# EAGLE schematic devboard (EAGLE 6.4)
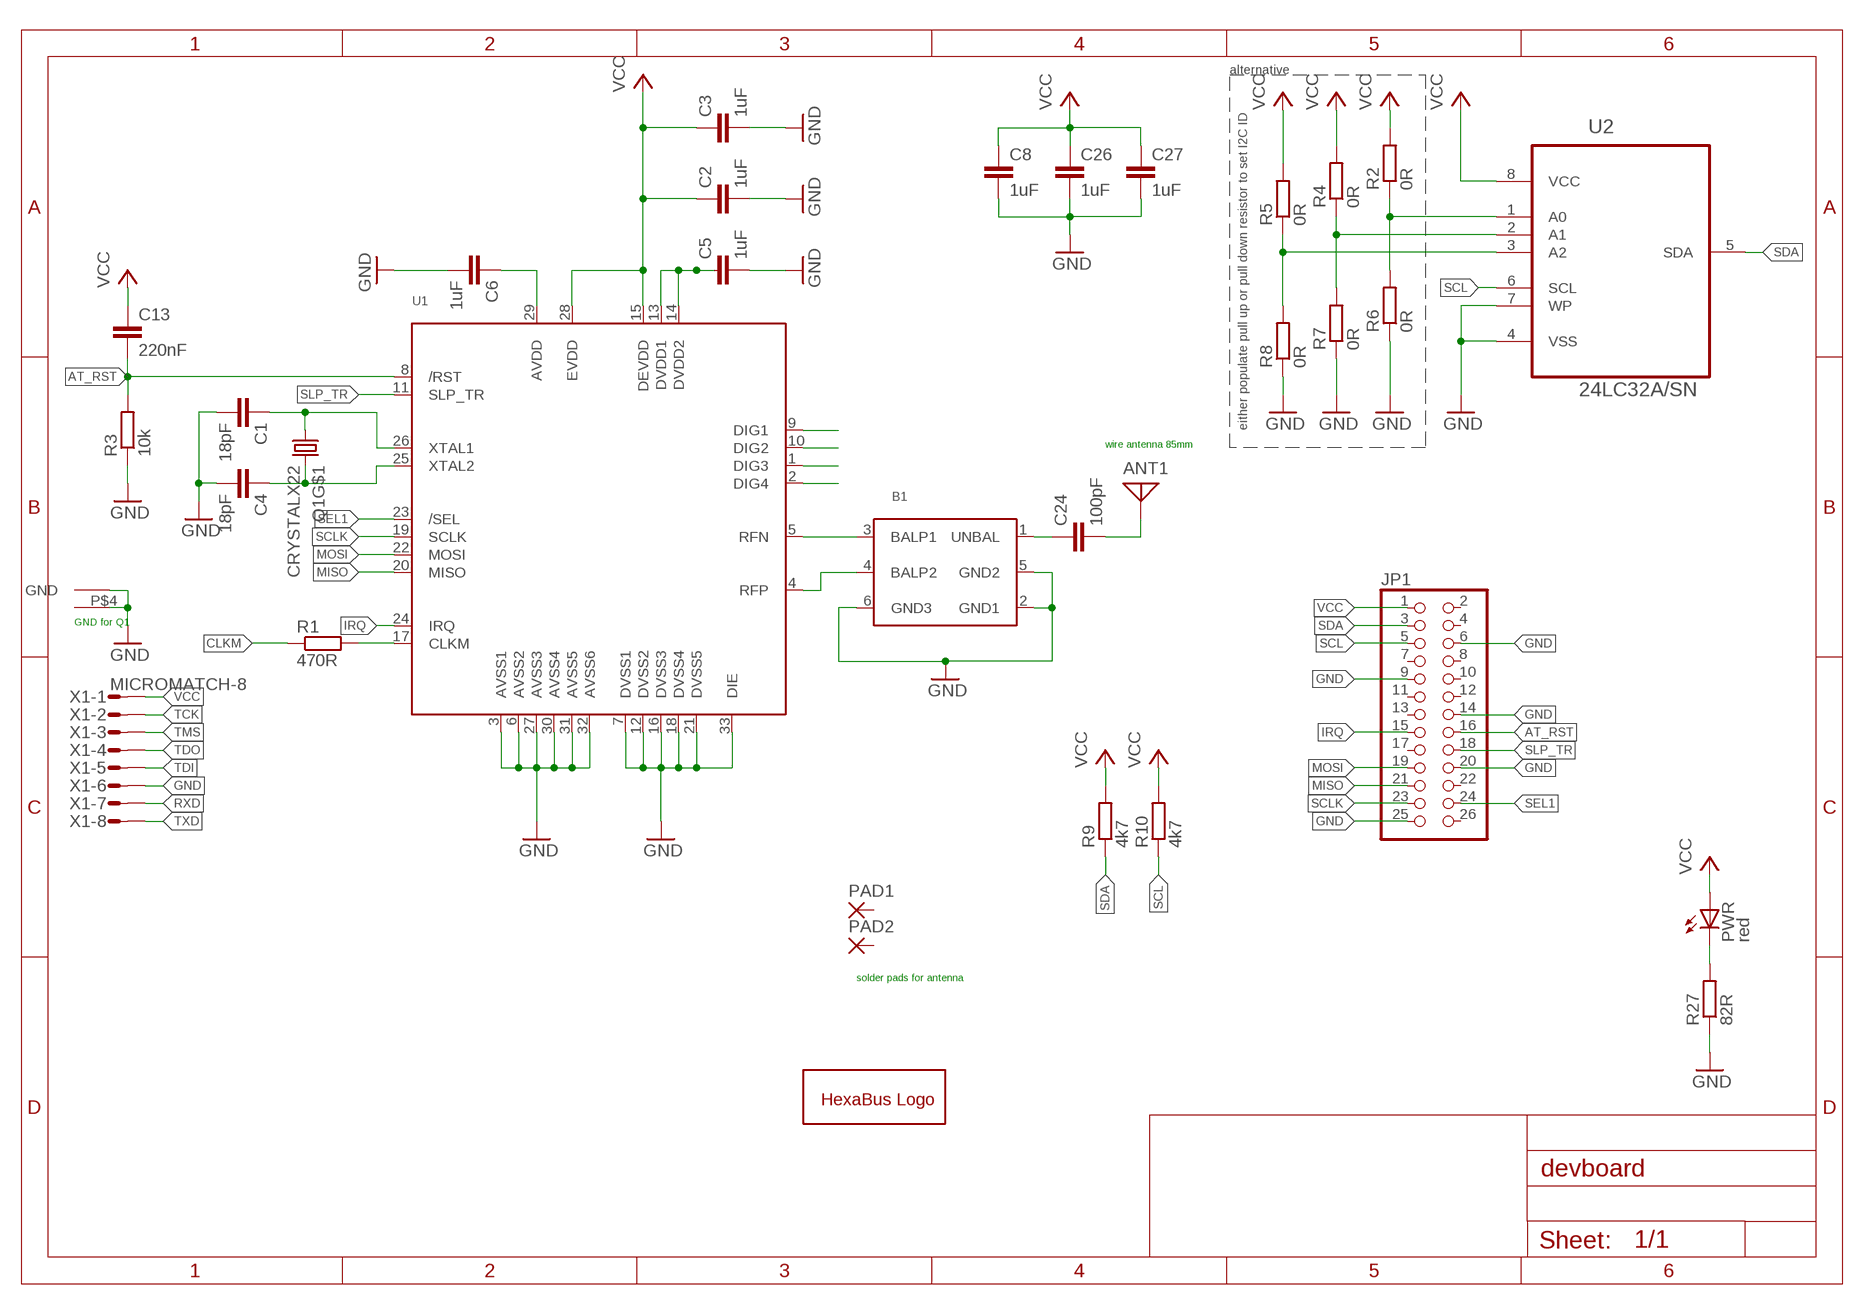
[diagram p0: schematic, sheet 1]

## Parts
ANT1  ANTENNA  [PAD-01]
B1  BALUN+LP  [BALUN0805]
C1  18pF  C-EUC0603  [C0603]
C2  1uF  C-EUC0603  [C0603]
C3  1uF  C-EUC0603  [C0603]
C4  18pF  C-EUC0603  [C0603]
C5  1uF  C-EUC0603  [C0603]
C6  1uF  C-EUC0603  [C0603]
C8  1uF  C-EUC0603  [C0603]
C13  220nF  C-EUC0603  [C0603]
C24  100pF  C-EUC0603  [C0603]
C26  1uF  C-EUC0603  [C0603]
C27  1uF  C-EUC0603  [C0603]
JP1  PINHD-2X13  [2X13]
PAD1  SMD2  [SMD1,27-2,54]
PAD2  SMD2  [SMD1,27-2,54]
PWR  red  LEDCHIP-LED0603  [CHIP-LED0603]
Q1  CRYSTALX22  [X22]
R1  470R  R-EU_R0603  [R0603]
R2  0R  R-EU_R0603  [R0603]
R3  10k  R-EU_R0603  [R0603]
R4  0R  R-EU_R0603  [R0603]
R5  0R  R-EU_R0603  [R0603]
R6  0R  R-EU_R0603  [R0603]
R7  0R  R-EU_R0603  [R0603]
R8  0R  R-EU_R0603  [R0603]
R9  4k7  R-EU_R0603  [R0603]
R10  4k7  R-EU_R0603  [R0603]
R27  82R  R-EU_R0603  [R0603]
U1  AT86RF212  [32QN2]
U2  24LC32A/SN  [SOIC127P600X175-8N]
U$1  HEXAKRAKE  [HEXAKRAKE]
X1  MICROMATCH-8  [MICROMATCH-8]

## Nets
AT_RST: C13.2 JP1.16 R3.2 U1.8(/RST)
CLKM: R1.1
GND: B1.2(GND1) B1.5(GND2) B1.6(GND3) C1.2 C2.2 C3.2 C4.2 C5.2 C6.2 C8.2 C26.2 C27.2 JP1.6 JP1.9 JP1.14 JP1.20 JP1.25 Q1.P$2(GND) Q1.P$4(GND1) R3.1 R6.1 R7.1 R8.1 R27.1 U1.3(AVSS1) U1.6(AVSS2) U1.7(DVSS1) U1.12(DVSS2) U1.16(DVSS3) U1.18(DVSS4) U1.21(DVSS5) U1.27(AVSS3) U1.30(AVSS4) U1.31(AVSS5) U1.32(AVSS6) U1.33(DIE) U2.4(VSS) U2.7(WP) X1.6
IRQ: JP1.15 U1.24(IRQ)
MISO: JP1.21 U1.20(MISO)
MOSI: JP1.19 U1.22(MOSI)
N$1: C6.1 U1.29(AVDD)
N$2: C5.1 U1.13(DVDD1) U1.14(DVDD2)
N$3: U1.9(DIG1)
N$4: R2.1 R6.2 U2.1(A0)
N$5: R1.2 U1.17(CLKM)
N$6: U1.10(DIG2)
N$7: U1.1(DIG3)
N$8: U1.2(DIG4)
N$9: R4.1 R7.2 U2.2(A1)
N$10: R5.1 R8.2 U2.3(A2)
N$28: B1.3(BALP1) U1.5(RFN)
N$29: B1.4(BALP2) U1.4(RFP)
N$30: C1.1 Q1.P$1 U1.26(XTAL1)
N$31: C4.1 Q1.P$3 U1.25(XTAL2)
N$32: PWR.C R27.2
N$33: B1.1(UNBAL) C24.1
N$34: ANT1.1 C24.2
RXD: X1.7
SCL: JP1.5 R10.1 U2.6(SCL)
SCLK: JP1.23 U1.19(SCLK)
SDA: JP1.3 R9.1 U2.5(SDA)
SEL1: JP1.24 U1.23(/SEL)
SLP_TR: JP1.18 U1.11(SLP_TR)
TCK: X1.2
TDI: X1.5
TDO: X1.4
TMS: X1.3
TXD: X1.8
VCC: C2.1 C3.1 C8.1 C13.1 C26.1 C27.1 JP1.1 PWR.A R2.2 R4.2 R5.2 R9.2 R10.2 U1.15(DEVDD) U1.28(EVDD) U2.8(VCC) X1.1
Unconnected: JP1.2 JP1.4 JP1.7 JP1.8 JP1.10 JP1.11 JP1.12 JP1.13 JP1.17 JP1.22 JP1.26 PAD1.1(P) PAD2.1(P)

## Notes on the sheet
- alternative
- either populate pull up or pull down resistor to set I2C ID
- wire antenna 85mm
- GND for Q1
- solder pads for antenna

## Library data of the parts
ANT1 = discrete:ANTENNA: Antenna
B1 = microbuilder:BALUN+LP: Balun + Low Pass Filter 0805 863-928 MHz Balun + Low Pass Filter (0805) - Digikey: 712-1473-1-ND
C1-C6 C8 C13 C24 C26 C27 = rcl:C-EU: CAPACITOR, European symbol
JP1 = pinhead:PINHD-2X13: PIN HEADER
PAD1 PAD2 = wirepad:SMD2: SMD PAD
PWR = led:LED: LED OSRAM: - CHIPLED LG R971, LG N971, LY N971, LG Q971, LY Q971, LO R971, LY R971 LH N974, LH R974 LS Q976, LO Q976, LY Q976 LO Q996 - Hyper CHIPLED LW Q18S LB Q993, LB Q99A, LB R99A - SideLED LS A670, LO A670, LY A670, LG A670, LP A670 LB A673, LV A673, LT A673, LW A673 LH A674 LY A675 LS A676, LA A676, LO A676, LY A676, LW A676 LS A679, LY A679, LG A679 - Hyper Micro SIDELED® LS Y876, LA Y876, LO Y876, LY Y876 LT Y87S - SmartLED LW L88C, LW L88S LB L89C, LB L89S, LG L890 LS L89K, LO L89K, LY L89K LS L896, LA L896, LO L896, LY L896 - TOPLED LS T670, LO T670, LY T670, LG T670, LP T670 LSG T670, LSP T670, LSY T670, LOP T670, LYG T670 LG T671, LOG T671, LSG T671 LB T673, LV T673, LT T673, LW T673 LH T674 LS T676, LA T676, LO T676, LY T676, LB T676, LH T676, LSB T676, LW T676 LB T67C, LV T67C, LT T67C, LS T67K, LO T67K, LY T67K, LW E67C LS E67B, LA E67B, LO E67B, LY E67B, LB E67C, LV E67C, LT E67C LW T67C LS T679, LY T679, LG T679 LS T770, LO T770, LY T770, LG T770, LP T770 LB T773, LV T773, LT T773, LW T773 LH T774 LS E675, LA E675, LY E675, LS T675 LS T776, LA T776, LO T776, LY T776, LB T776 LHGB T686 LT T68C, LB T68C - Hyper Mini TOPLED® LB M676 - Mini TOPLED Santana® LG M470 LS M47K, LO M47K, LY M47K Source: http://www.osram.convergy.de LUXEON: - LUMILED® LXK2-PW12-R00, LXK2-PW12-S00, LXK2-PW14-U00, LXK2-PW14-V00 LXK2-PM12-R00, LXK2-PM12-S00, LXK2-PM14-U00 LXK2-PE12-Q00, LXK2-PE12-R00, LXK2-PE12-S00, LXK2-PE14-T00, LXK2-PE14-U00 LXK2-PB12-K00, LXK2-PB12-L00, LXK2-PB12-M00, LXK2-PB14-N00, LXK2-PB14-P00, LXK2-PB14-Q00 LXK2-PR12-L00, LXK2-PR12-M00, LXK2-PR14-Q00, LXK2-PR14-R00 LXK2-PD12-Q00, LXK2-PD12-R00, LXK2-PD12-S00 LXK2-PH12-R00, LXK2-PH12-S00 LXK2-PL12-P00, LXK2-PL12-Q00, LXK2-PL12-R00 Source: www.luxeon.com KINGBRIGHT: KA-3528ASYC Source: www.kingbright.com
Q1 = crystals-new:CRYSTAL
R1-R10 R27 = rcl:R-EU_: RESISTOR, European symbol
U1 = microbuilder:AT86RF212: AT86RF212 - Low-Power SPI-based 700/800/900 MHz Transceiver Digikey: AT86RF212-ZU-ND
U2 = hexabus:24LC32A/SN: 32 K bit Serial EEPROM; MPN: 24LC32A/SN; OC_FARNELL: 9758003; OC_NEWARK: 33C2976; PACKAGE: SOIC-8; SUPPLIER: Microchip
U$1 = artwork:HEXAKRAKE
X1 = con-amp-micromatch:MICROMATCH-8: MicroMaTch 8 7-215464-8 / 0-215464-8 Drawing Number C-215464 DDEController.pdf; MF: FARNELL; MPN: 7-215464-8; OC_FARNELL: 3784642; OC_NEWARK: 26H0301